# Altium schematic sheet rf-fem.SchDoc
size A4; SheetNumber: 3; SheetTotal: 5; SPICEModelCacheTDSFWHTR: <root> / <DocumentId>TDSFWHTR</DocumentId> / </root>
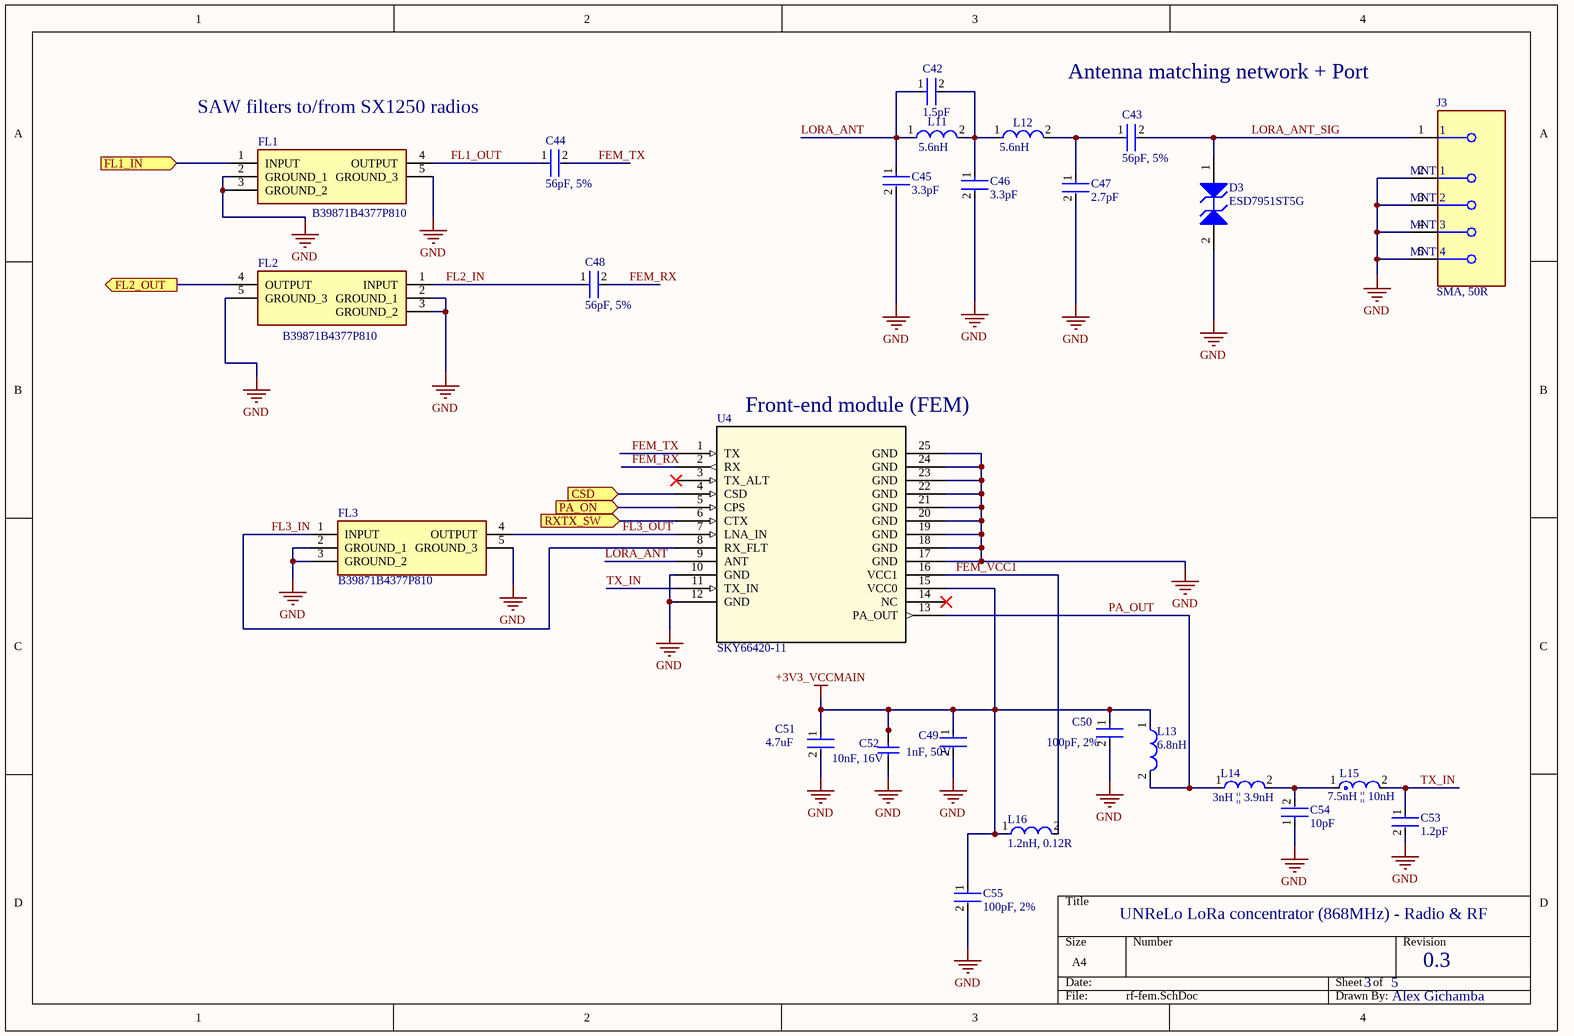
[diagram p0: rf-fem.SchDoc]

## Parts
C42  1.5pF  [FP-GJM155-0_05-IPC_C]
C43  56pF, 5%  [FP-GCM188-0_1-IPC_A]
C44  56pF, 5%  [FP-GCM188-0_1-IPC_A]
C45  3.3pF  [FP-GQM187-0_15-MFG]
C46  3.3pF  [FP-GQM187-0_15-MFG]
C47  2.7pF  [FP-CL428-IPC_C]
C48  56pF, 5%  [FP-GCM188-0_1-IPC_A]
C49  1nF, 50V  [FP-CL10-IPC_A]
C50  100pF, 2%  [FP-0805-L_2_01_0_2-W_1_25-IPC_A]
C51  4.7uF  [FP-CL21-IPC_A]
C52  10nF, 16V  [CAPC1608X90X35NL15T15]
C53  1.2pF  [FP-CL110-IPC_C]
C54  10pF  [FP-CL10-IPC_A]
C55  100pF, 2%  [FP-0805-L_2_01_0_2-W_1_25-IPC_A]
D3  ESD7951ST5G  [ONSC-SOD-923-2-514AB-01_V]
FL1  B39871B4377P810  [B39871B4377P810]
FL2  B39871B4377P810  [B39871B4377P810]
FL3  B39871B4377P810  [B39871B4377P810]
J3  SMA, 50R  [FP-SMA-J-P-H-ST-EM1-MFG]
L11  5.6nH  [FP-LQW18AN_80-MFG]
L12  5.6nH  [FP-LQW18AN_80-MFG]
L13  6.8nH  [FP-LQW15AN_00-W0_6-0_1-MFG]
L14  3nH || 3.9nH  [FP-MLK1005-IPC_B]
L15  7.5nH || 10nH  [FP-LQG15HH_02-IPC_A]
L16  1.2nH, 0.12R  [FP-MLK1005-IPC_C]
U4  SKY66420-11  [MCM16_3X3X0P75_SKY]

## Ports
CSD (in), FL1_IN (in), FL2_OUT (out), PA_ON (in), RXTX_SW (in)

## Nets
+3V3_VCCMAIN: C49.1 C50.1 C51.1 C52.2 C55.1 L13.1 L16.1 U4.15(VCC0)
GND: C45.2 C46.2 C47.2 C49.2 C50.2 C51.2 C52.1 C53.2 C54.1 C55.2 D3.2(A2) FL1.2(GROUND_1) FL1.3(GROUND_2) FL1.5(GROUND_3) FL2.2(GROUND_1) FL2.3(GROUND_2) FL2.5(GROUND_3) FL3.2(GROUND_1) FL3.3(GROUND_2) FL3.5(GROUND_3) J3.2(MNT_1) J3.3(MNT_2) J3.4(MNT_3) J3.5(MNT_4) U4.10(GND) U4.12(GND) U4.17(GND) U4.18(GND) U4.19(GND) U4.20(GND) U4.21(GND) U4.22(GND) U4.23(GND) U4.24(GND) U4.25(GND)
CSD: U4.4(CSD) ; port CSD
FEM_RX: C48.2 U4.2(RX)
FEM_TX: C44.2 U4.1(TX)
FEM_VCC1: L16.2 U4.16(VCC1)
FL1_IN: FL1.1(INPUT) ; port FL1_IN
FL1_OUT: C44.1 FL1.4(OUTPUT)
FL2_IN: C48.1 FL2.1(INPUT)
FL2_OUT: FL2.4(OUTPUT) ; port FL2_OUT
FL3_IN: FL3.1(INPUT) U4.8(RX_FLT)
FL3_OUT: FL3.4(OUTPUT) U4.7(LNA_IN)
LORA_ANT: C42.1 C45.1 L11.1 U4.9(ANT)
LORA_ANT_SIG: C43.2 D3.1(A1) J3.1
PA_ON: U4.5(CPS) ; port PA_ON
PA_OUT: L13.2 L14.1 U4.13(PA_OUT)
RXTX_SW: U4.6(CTX) ; port RXTX_SW
TX_IN: C53.1 L15.2 U4.11(TX_IN)
NetC42_2: C42.2 C46.1 L11.2 L12.1
NetC43_1: C43.1 C47.1 L12.2
NetC54_2: C54.2 L14.2 L15.1

Not connected (* = marked no-connect by the designer): U4 3(TX_ALT)* 14(NC)*

## Notes on the sheet
- SAW filters to/from SX1250 radios
- Antenna matching network + Port
- (near U4) Front-end module (FEM)
- UNReLo LoRa concentrator (868MHz) - Radio & RF
- 3
- 5
- 0.3
- Alex Gichamba

## Library data of the parts
C42 = CMP-2008-03820-2: Multi-Layer Ceramic Capacitor 1.5pF C0G  ±0.1pF 0402 Paper T/R; Temperature Coefficient: 30ppm/°C; Voltage Rating: 50V; Depth: 0.5mm; Case Code (Imperial): 0402; Package Quantity: 10000; Length: 1mm; Number of Pins: 2; Max Operating Temperature: 125°C; Mount: Surface Mount; Construction: Flat; Thickness: 0.022inch; Series: GJM; Packaging: Tape and Reel; Radiation Hardening: No; REACH SVHC: No SVHC; Case/Package: 0402; Lead Free: Lead Free; Voltage Rating (DC): 50V; Min Operating Temperature: -55°C; Dielectric: C0G; Termination: SMD/SMT; Width: 0.5mm; Capacitance: 1.5pF; Lead Pitch: 0.3mm; Case Code (Metric): 1005; Voltage: 50V; Height: 0.5mm
C43 C44 C48 = CMP-06035-013037-1: Ceramic Capacitor for Automotive 56pF  ±5% 100VDC C0G 0603 Paper T/R; Voltage Rating: 100V; Max Operating Temperature: 125°C; Packaging: Tape and Reel; Depth: 0.8mm; Mount: Surface Mount; Case Code (Imperial): 0603; Length: 1.6mm; Case Code (Metric): 1608; Capacitance: 56pF; Case/Package: 0603; Width: 0.8mm; Termination: SMD/SMT; Dielectric: C0G; Radiation Hardening: No; Tolerance: 5%; Package Quantity: 4000; Thickness: 0.035inch; Ratings: AEC-Q200; Min Operating Temperature: -25°C; Height: 0.8mm; Voltage Rating (DC): 100V
C45 C46 = CMP-2006-03899-2: Ceramic Capacitor 3.3pF ±0.1pF 250VDC C0G 0603 Paper T/R; Voltage Rating: 250V; Max Operating Temperature: 125°C; Case Code (Imperial): 0603; Depth: 0.8mm; Width: 0.8mm; Package Quantity: 4000; Height: 0.7mm; Case Code (Metric): 1608; Case/Package: 0603; Radiation Hardening: No; Min Operating Temperature: -55°C; Thickness: 0.031inch; Dielectric: C0G; Length: 1.6mm; Mount: Surface Mount; Packaging: Tape and Reel; Termination: SMD/SMT; Voltage Rating (DC): 250V; Capacitance: 3.3pF
C47 = CMP-13271-004210-1: Cap Ceramic 2.7pF 50V C0G ±0.1pF SMD 0402 +125°C Paper T/R; Temperature Coefficient: 300ppm/°C; Max Operating Temperature: 125°C; Package Quantity: 1; Voltage Rating: 50V; Case Code (Imperial): 0402; Capacitance: 2.7pF; Case/Package: 0402; Voltage: 50V; Width: 0.02inch; Thickness: 0.022inch; Length: 1mm; Radiation Hardening: No; Height: 0.5mm; Min Operating Temperature: -55°C; Depth: 0.5mm; Packaging: Tape and Reel; Case Code (Metric): 1005; Dielectric: C0G; Mount: Surface Mount
C49 = CMP-13271-004807-1: Cap Ceramic 1nF 50V C0G ±5% Pad SMD 0603 +125°C T/R; Temperature Coefficient: 300ppm/°C; Voltage Rating (DC): 50V; Length: 1.6mm; Width: 0.031inch; Series: CL; Case Code (Imperial): 0603; Voltage: 50V; Lead Free: Lead Free; Packaging: Tape and Reel; Dielectric: C0G; Material: Ceramic; Thickness: 0.035inch; Max Operating Temperature: 125°C; Package Quantity: 1; RoHS Compliant: Yes; Radiation Hardening: No; Capacitance: 1nF; Mount: Surface Mount; Voltage Rating: 50V; Height: 0.8mm; Tolerance: 5%; Min Operating Temperature: -55°C; Case Code (Metric): 1608; Case/Package: 0603; Depth: 0.8mm
C50 C55 = CMP-2007-04121-2: General Purpose Ceramic Capacitor, 0805, 100pF, 5%, C0G, 30ppm/°C, 100V; Insulation Resistance: 100GR; Contact Plating: Tin; REACH SVHC: No SVHC; Temperature Coefficient: 30ppm/°C; Length: 2.01mm; Lead Free: Lead Free; Number of Pins: 2; Packaging: Tape and Reel; Dielectric: C0G; Width: 0.049inch; Case Code (Imperial): 0805; Max Operating Temperature: 125°C; Height: 0.94mm; Tolerance: 5%; Case Code (Metric): 2012; Construction: Flat; Voltage Rating: 100V; Thickness: 0.037inch; Case/Package: 0805; Package Quantity: 1; Size: 0.94mm; Depth: 1.25mm; Voltage: 100V; Min Operating Temperature: -55°C; RoHS Compliant: Yes; Termination: SMD/SMT; Mount: Surface Mount; Series: -; Radiation Hardening: No; Voltage Rating (DC): 100V; Capacitance: 100pF
C51 = CMP-13271-002624-1: CL21 Series 0805 4.7uF 25V ±10% Tolerance X5R Multilayer Ceramic Chip Capacitor; Case Code (Imperial): 0805; Thickness: 0.055inch; Mount: Surface Mount; Case Code (Metric): 2012; Capacitance: 4.7uF; Depth: 1.25mm; Lead Free: Lead Free; Case/Package: 0805; Voltage Rating: 25V; Package Quantity: 1; Width: 0.049inch; Radiation Hardening: No; Voltage Rating (DC): 25V; Length: 2mm; Dielectric: X5R; Height: 1.25mm; Packaging: Tape and Reel; Tolerance: 10%; Min Operating Temperature: -55°C; Max Operating Temperature: 85°C
C52 = CMP-2006-02084-1: Manufacturer: AVX Interconnect / Elco; Part Number: 0603YC103JAT2A
C53 = CMP-13271-001697-1: Cap Ceramic 1.2pF 50V C0G ±0.25pF SMD 0402 +125°C Paper T/R; Temperature Coefficient: 300ppm/°C; Length: 1mm; Dielectric: C0G; Lead Free: Lead Free; Case Code (Metric): 1005; Case/Package: 0402; Height: 0.5mm; Radiation Hardening: No; Case Code (Imperial): 0402; Voltage: 50V; Voltage Rating (DC): 50V; Package Quantity: 1; Width: 0.02inch; Max Operating Temperature: 125°C; Min Operating Temperature: -55°C; Voltage Rating: 50V; Capacitance: 1.2pF; Mount: Surface Mount; Thickness: 0.022inch; Packaging: Tape and Reel; Depth: 0.5mm
C54 = CMP-13271-001725-1: Cap Ceramic 10pF 50V C0G ±5% Pad SMD 0603 +125°C T/R; Temperature Coefficient: 300ppm/°C; Packaging: Tape and Reel; Voltage: 50V; Lead Free: Lead Free; Voltage Rating: 50V; Dielectric: C0G; Package Quantity: 10000; Depth: 0.8mm; Mount: Surface Mount; Capacitance: 10pF; Thickness: 0.035inch; Tolerance: 5%; Length: 1.6mm; Voltage Rating (DC): 50V; Width: 0.031inch; Radiation Hardening: No; Max Operating Temperature: 125°C; Case/Package: 0603; Height: 0.8mm; Min Operating Temperature: -55°C
D3 = CMP-1063-00118-1: Transient Voltage Suppressor, ESD Protection Diode with Ultra-Low Capacitance, 2-Pin SOD-923, Pb-Free, Tape and Reel; Manufacturer: On Semiconductor; C Max (pF): 0.9; VRWM Max (V): 5; IR Max (uA): 1; V(BR) Min (V): 5.4; Direction: Bidirectional; PackageReference: SOD-923-2-514AB-01; ComponentLink1URL: http://www.onsemi.com/; RoHS: Pb-Free; Packing: Tape and Reel; PartNumber: ESD7951ST5G; ComponentLink2URL: http://www.onsemi.cn/pub_link/Collateral/ESD7951S-D.PDF; ComponentLink1Description: Manufacturer URL; PackageDescription: 2-Pin SOD, Body 0.8 x 0.6 mm; PackageVersion: Rev. C, 03/2011; ComponentLink3URL: http://www.onsemi.com/pub_link/Collateral/514AB.PDF; Mounting Technology: Surface Mount; ComponentLink3Description: Package Specification; DatasheetVersion: Rev. 2; Number of Lines: 1; ComponentLink2Description: Datasheet
FL1-FL3 = B39871B4377P810: Filter; Manufacturer_Name: RF360; Datasheet Link: https://www.mouser.com/datasheet/2/842/B4377-1626970.pdf; Height: 0.45mm; Manufacturer_Part_Number: B39871B4377P810; Mouser Part Number: 871-B39871B4377P810; Mouser Price/Stock: https://www.mouser.co.uk/ProductDetail/RF360/B39871B4377P810?qs=bZr6mbWTK5lyUVtaiWMrAA%3D%3D
J3 = CMP-02754-000006-1: CONN SMA JACK STR 50OHM EDGE MNT; Dielectric Material: PTFE; Center Contact Plating: Gold; Max Frequency: 6GHz; Body Material: Brass; Voltage Rating: 335V; Package Quantity: 1; Case/Package: SMA; Max Operating Temperature: 125°C; Fastening Type: Threaded; Orientation: Straight; Depth: 13.33mm; RoHS Compliant: Yes; Length: 6.35mm; Insulation Material: Polytetrafluoroethylene; Termination: Solder; Min Operating Temperature: -65°C; Housing Color: Gold; Impedance: 50R; Contact Plating: Gold; Contact Material: Copper; Connector Type: SMA; Mount: Edge; Series: SMA; Packaging: Tray; Body Plating: Gold; Radiation Hardening: No
L11 L12 = CMP-06042-011166-1: Wire Wound RF Inductor for Automotive 5.6nH ±2% 1900mA 0.04Ω 0603 (1608); Core Material: Non-Magnetic; Test Frequency: 100MHz; Self Resonant Frequency: 6.65GHz; Current Rating: 1.9A; Shielding: Unshielded; DC Resistance (DCR): 40mR; Case Code (Metric): 1608; Ratings: AEC-Q200; Mount: Surface Mount; Min Operating Temperature: -55°C; Max Operating Temperature: 125°C; Tolerance: 2%; Case Code (Imperial): 0603; Packaging: Cut Tape; Resistor Type: Wirewound; Inductance: 5.6nH; Case/Package: 0603
L13 = CMP-06042-003653-1: Wire Wound RF Inductor 6.8nH ±5% 700mA 0.09Ω 0402 (1005); DC Resistance (DCR): 90mR; Q Factor: 25; Shielding: Unshielded; Test Frequency: 100MHz; Core Material: Air; Self Resonant Frequency: 6GHz; Case Code (Metric): 1005; Termination: SMD/SMT; Max DC Current: 700mA; Max Operating Temperature: 125°C; Depth: 0.7mm; DC Current: 700mA; Length: 1mm; Case/Package: 0402; Height: 0.5mm; Package Quantity: 10000; Case Code (Imperial): 0402; Mount: Surface Mount; Tolerance: 5%; Inductance: 6.8nH; Packaging: Tape and Reel; Width: 0.02inch; Weight: 2.8E-05oz; Radiation Hardening: No; Military Standard: Not; Lead Free: Lead Free; Min Operating Temperature: -55°C; Current Rating: 700mA
L14 = CMP-08253-000370-1: Unshielded Multilayer Inductor 2nH ±0.3nH 500mA 0.18Ω SMD 0402; Test Frequency: 100MHz; Self Resonant Frequency: 8.3GHz; DC Resistance (DCR): 180mR; Core Material: Ceramic; Case Code (Imperial): 0402; Max Operating Temperature: 125°C; Case/Package: 0402; Shielding: Unshielded; RoHS Compliant: Yes; Inductance: 2nH; Current Rating: 500mA; Case Code (Metric): 1005; Length: 0.039inch; Width: 0.02inch; Packaging: Tape and Reel; Mount: Surface Mount; Height - Seated (Max): 0.024inch; Package Quantity: 1; Min Operating Temperature: -55°C
L15 = CMP-06042-014117-1: Multilayer type RF Inductor 10nH ±5% 0.26Ω 500mA 0402; DC Resistance (DCR): 260mR; DC Current: 300mA; Shielding: Unshielded; Q Factor: 8; Test Frequency: 100MHz; Self Resonant Frequency: 3.4GHz; Core Material: Air; Width: 0.5mm; Radiation Hardening: No; Packaging: Tape and Reel; Lead Free: Lead Free; Military Standard: Not; Case/Package: 0402; Current Rating: 300mA; Case Code (Metric): 1005; Length: 0.039inch; Termination: SMD/SMT; Max DC Current: 300mA; Max Operating Temperature: 125°C; Mount: Surface Mount; Height - Seated (Max): 0.022inch; Package Quantity: 10000; Height: 0.5mm; Inductance: 10nH; Tolerance: 5%; Case Code (Imperial): 0402; Depth: 0.55mm; Min Operating Temperature: -55°C
L16 = CMP-08253-000376-1: Unshielded Multilayer Inductor 1.2nH ±0.3nH 500mA 0.12Ω SMD 0402; Test Frequency: 100MHz; DC Resistance (DCR): 120mR; Self Resonant Frequency: 11GHz; Core Material: Ceramic; Width: 0.02inch; Min Operating Temperature: -55°C; Shielding: Unshielded; Current Rating: 500mA; Case Code (Imperial): 0402; Height: 0.6mm; Package Quantity: 1; Max Operating Temperature: 125°C; Inductance: 1.2nH; Packaging: Tape and Reel; Length: 0.039inch; Case Code (Metric): 1005; RoHS Compliant: Yes; Mount: Surface Mount; Height - Seated (Max): 0.024inch; Series: MLK; Radiation Hardening: No; Max DC Current: 500mA; Depth: 0.6mm; Case/Package: 0402
U4 = SKY66420-11: Built for UNReLo. 860 to 930 MHz RF Front-End Module; Mfr_Name: Skyworks; Copyright: Copyright (C) 2022 Ultra Librarian. All rights reserved.; Manufacturer_Part_Number: SKY66420-11; Digi-Key_Part_Number_1: 863-2028-2-ND; Digi-Key_Part_Number_2: 863-2028-1-ND; Digi-Key_Part_Number_3: 863-2028-6-ND; RefDes: RefDes; Type: DEV